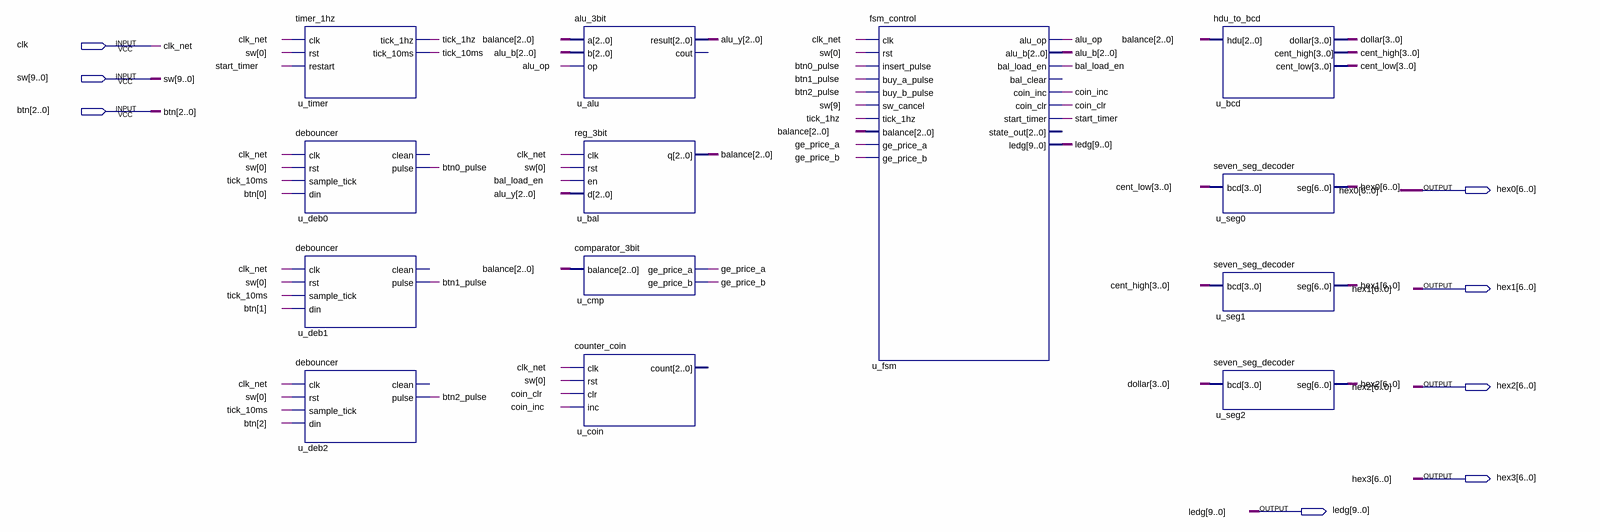
[diagram p0: schematic sheet]
// Quartus schematic vending_internals.bdf as structural Verilog: 13 symbols, 8 pins
module vending_internals (
  input  clk,
  input  [9:0] sw,
  input  [2:0] btn,
  output [6:0] hex0,
  output [6:0] hex1,
  output [6:0] hex2,
  output [6:0] hex3,
  output [9:0] ledg
);

  wire alu_op, bal_load_en, btn0_pulse, btn1_pulse, btn2_pulse, coin_clr, coin_inc, ge_price_a, ge_price_b,
       start_timer, tick_1hz, tick_10ms;
  wire [2:0] alu_b, alu_y, balance;
  wire [3:0] cent_high, cent_low, dollar;

  timer_1hz u_timer (.clk(clk), .rst(sw[0]), .restart(start_timer), .tick_1hz(tick_1hz), .tick_10ms(tick_10ms));
  debouncer u_deb0 (.clk(clk), .rst(sw[0]), .sample_tick(tick_10ms), .din(btn[0]), .pulse(btn0_pulse));  // open: clean
  debouncer u_deb1 (.clk(clk), .rst(sw[0]), .sample_tick(tick_10ms), .din(btn[1]), .pulse(btn1_pulse));  // open: clean
  debouncer u_deb2 (.clk(clk), .rst(sw[0]), .sample_tick(tick_10ms), .din(btn[2]), .pulse(btn2_pulse));  // open: clean
  alu_3bit u_alu (.a(balance), .b(alu_b), .op(alu_op), .result(alu_y));  // open: cout
  reg_3bit u_bal (.clk(clk), .rst(sw[0]), .en(bal_load_en), .d(alu_y), .q(balance));
  comparator_3bit u_cmp (.balance(balance), .ge_price_a(ge_price_a), .ge_price_b(ge_price_b));
  counter_coin u_coin (.clk(clk), .rst(sw[0]), .clr(coin_clr), .inc(coin_inc));  // open: count
  fsm_control u_fsm (
    .clk(clk), .rst(sw[0]), .insert_pulse(btn0_pulse), .buy_a_pulse(btn1_pulse), .buy_b_pulse(btn2_pulse),
    .sw_cancel(sw[9]), .tick_1hz(tick_1hz), .balance(balance), .ge_price_a(ge_price_a),
    .ge_price_b(ge_price_b), .alu_op(alu_op), .alu_b(alu_b), .bal_load_en(bal_load_en), .coin_inc(coin_inc),
    .coin_clr(coin_clr), .start_timer(start_timer), .ledg(ledg));  // open: bal_clear, state_out
  hdu_to_bcd u_bcd (.hdu(balance), .dollar(dollar), .cent_high(cent_high), .cent_low(cent_low));
  seven_seg_decoder u_seg0 (.bcd(cent_low), .seg(hex0));
  seven_seg_decoder u_seg1 (.bcd(cent_high), .seg(hex1));
  seven_seg_decoder u_seg2 (.bcd(dollar), .seg(hex2));

  // Other names for the same wires on the sheet: clk_net = clk
endmodule
